# Altium schematic sheet TSAL_Board_B.SchDoc: TSAL CIRCUIT
size A; Revision: 1; SheetNumber: 2; SheetTotal: 7
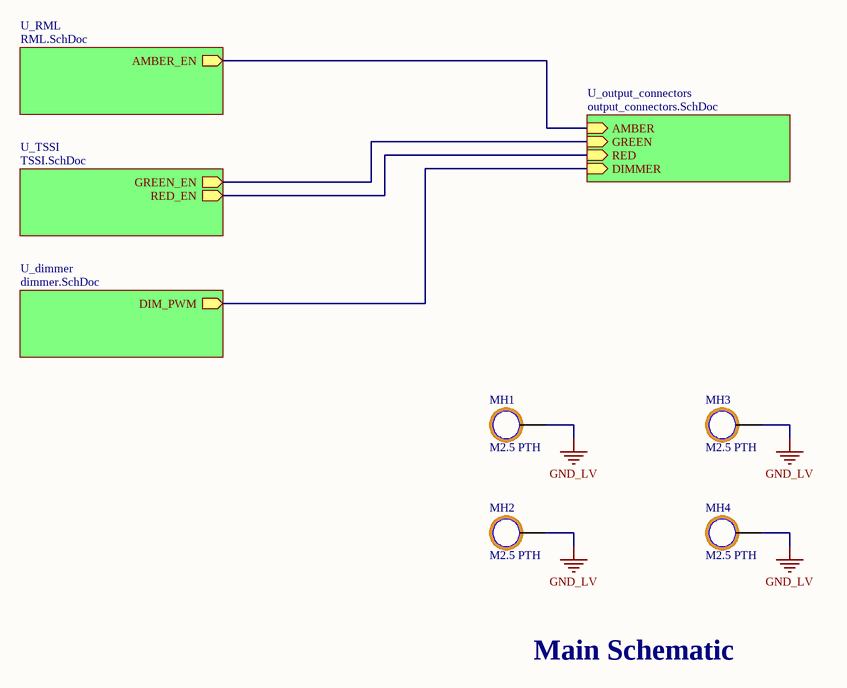
[diagram p0: TSAL_Board_B.SchDoc]

## Parts
MH1  M2.5 PTH  [MH__M2_5]  (no BOM)
MH2  M2.5 PTH  [MH__M2_5]  (no BOM)
MH3  M2.5 PTH  [MH__M2_5]  (no BOM)
MH4  M2.5 PTH  [MH__M2_5]  (no BOM)

## Sub-sheets
U_dimmer = dimmer.SchDoc: DIM_PWM (out)
U_output_connectors = output_connectors.SchDoc: AMBER (in), RED (in), GREEN (in), DIMMER (in)
U_RML = RML.SchDoc: AMBER_EN (out)
U_TSSI = TSSI.SchDoc: GREEN_EN (out), RED_EN (out)

## Nets
GND_LV: MH1.1 MH2.1 MH3.1 MH4.1
(unnamed): sheet U_dimmer/DIM_PWM, sheet U_output_connectors/DIMMER
(unnamed): sheet U_output_connectors/AMBER, sheet U_RML/AMBER_EN
(unnamed): sheet U_output_connectors/RED, sheet U_TSSI/RED_EN
(unnamed): sheet U_output_connectors/GREEN, sheet U_TSSI/GREEN_EN

## Notes on the sheet
- Main Schematic

## Library data of the parts
MH1-MH4 = CMP-066-000000-1: Max Operating Temperature: °C; PN: M2.5 PTH; Min Operating Temperature: °C